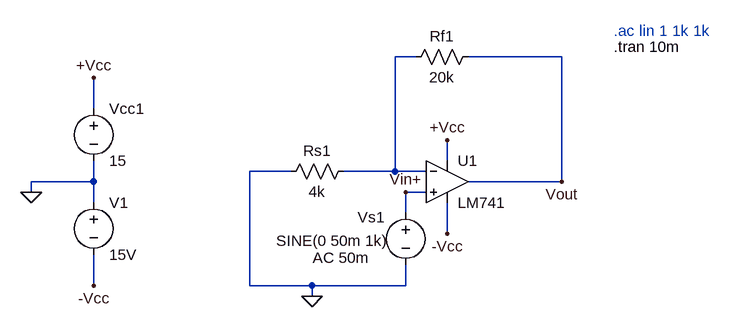
[diagram p0: schematic Non - Inverting Mode.asc]
Non - Inverting Mode.asc, the LTspice schematic file:
Version 4
SHEET 1 880 680
WIRE 176 16 144 16
WIRE 400 16 256 16
WIRE -320 96 -320 48
WIRE 224 176 224 144
WIRE -16 192 -80 192
WIRE 144 192 144 16
WIRE 144 192 64 192
WIRE 192 192 144 192
WIRE -320 208 -320 176
WIRE -320 208 -416 208
WIRE 400 208 400 16
WIRE 400 208 256 208
WIRE -416 224 -416 208
WIRE 192 224 160 224
WIRE -320 240 -320 208
WIRE 160 256 160 224
WIRE 224 288 224 240
WIRE -320 368 -320 320
WIRE -80 368 -80 192
WIRE 16 368 -80 368
WIRE 160 368 160 336
WIRE 160 368 16 368
WIRE 16 384 16 368
FLAG -416 224 0
FLAG -320 48 +Vcc
FLAG 224 144 +Vcc
FLAG -320 368 -Vcc
FLAG 224 288 -Vcc
FLAG 16 384 0
FLAG 400 208 Vout
FLAG 160 224 Vin+
SYMBOL Opamps\\LM741 224 144 R0
SYMATTR InstName U1
SYMBOL res 272 0 R90
WINDOW 0 0 56 VBottom 2
WINDOW 3 32 56 VTop 2
SYMATTR InstName Rf1
SYMATTR Value 20k
SYMBOL res 80 176 R90
WINDOW 0 0 56 VBottom 2
WINDOW 3 32 56 VTop 2
SYMATTR InstName Rs1
SYMATTR Value 4k
SYMBOL voltage 160 240 R0
WINDOW 0 -74 23 Left 2
WINDOW 3 -199 59 Left 2
WINDOW 123 -143 85 Left 2
WINDOW 39 0 0 Left 0
SYMATTR InstName Vs1
SYMATTR Value SINE(0 50m 1k)
SYMATTR Value2 AC 50m
SYMBOL voltage -320 80 R0
WINDOW 123 0 0 Left 0
WINDOW 39 0 0 Left 0
SYMATTR InstName Vcc1
SYMATTR Value 15
SYMBOL voltage -320 224 R0
WINDOW 123 0 0 Left 0
WINDOW 39 0 0 Left 0
SYMATTR InstName V1
SYMATTR Value 15V
TEXT 480 -24 Left 2 ;.ac lin 1 1k 1k
TEXT 480 0 Left 2 !.tran 10m

The netlist it stands for:
* Non - Inverting Mode.asc
XU1 Vin+ N001 +Vcc -Vcc Vout LM741  ; pins In+ In- V+ V- OUT
Rf1 Vout N001 20k
Rs1 N001 0 4k
Vs1 Vin+ 0 SINE(0 50m 1k) AC 50m
Vcc1 +Vcc 0 15
V1 0 -Vcc 15V
* .ac lin 1 1k 1k
.tran 10m
.lib LM741.lib
.backanno
.end